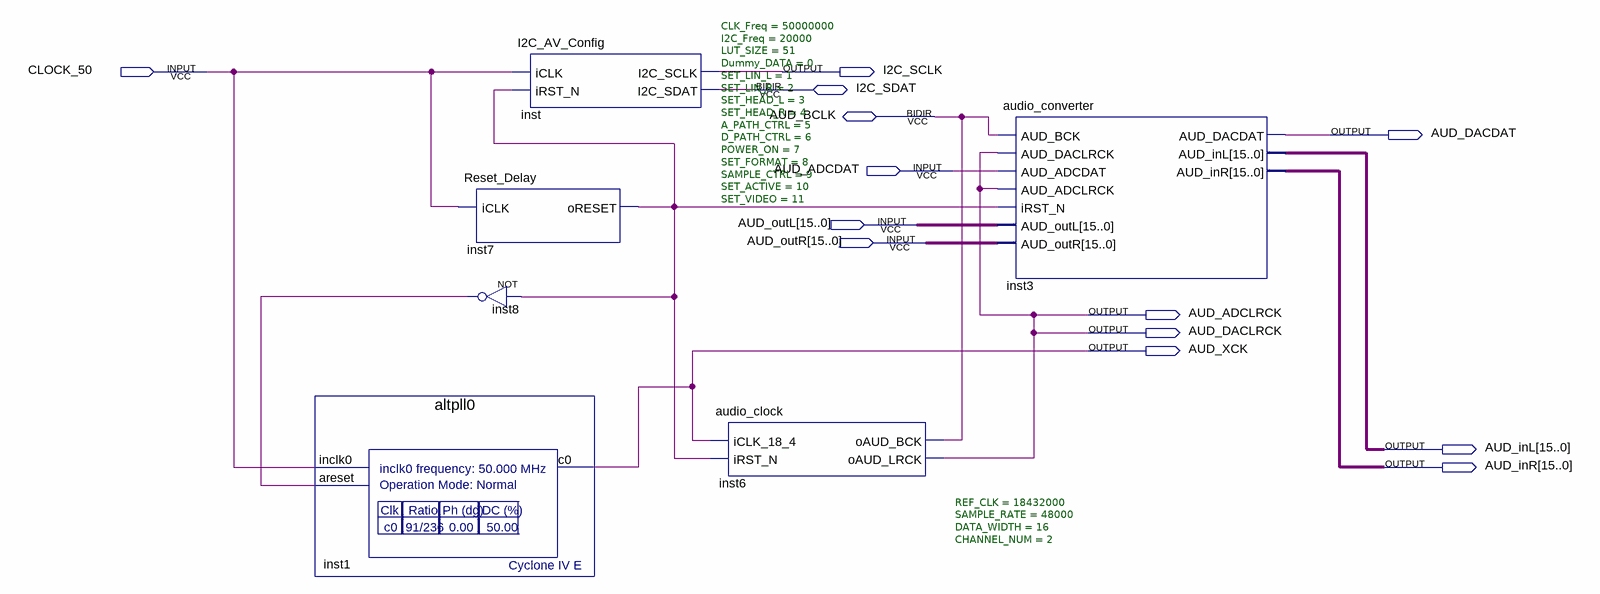
[diagram p0: schematic sheet]
// Quartus schematic DE2_i2sound.bdf as structural Verilog: 6 symbols, 13 pins
module DE2_i2sound (
  input  CLOCK_50,
  input  AUD_ADCDAT,
  input  [15:0] AUD_outL,
  input  [15:0] AUD_outR,
  inout  I2C_SDAT,
  inout  AUD_BCLK,
  output I2C_SCLK,
  output AUD_DACDAT,
  output AUD_ADCLRCK,
  output AUD_DACLRCK,
  output AUD_XCK,
  output [15:0] AUD_inL,
  output [15:0] AUD_inR
);

  wire inst7_oreset, inst8_out;

  altpll0 inst1 (.inclk0(CLOCK_50), .areset(inst8_out), .c0(AUD_XCK));
  Reset_Delay inst7 (.iCLK(CLOCK_50), .oRESET(inst7_oreset));
  not inst8 (inst8_out, inst7_oreset);
  I2C_AV_Config #(.CLK_Freq(50000000), .I2C_Freq(20000), .LUT_SIZE(51), .Dummy_DATA(0), .SET_LIN_L(1), .SET_LIN_R(2), .SET_HEAD_L(3), .SET_HEAD_R(4), .A_PATH_CTRL(5), .D_PATH_CTRL(6), .POWER_ON(7), .SET_FORMAT(8), .SAMPLE_CTRL(9), .SET_ACTIVE(10), .SET_VIDEO(11)) inst (
    .iCLK(CLOCK_50), .iRST_N(inst7_oreset), .I2C_SCLK(I2C_SCLK), .I2C_SDAT(I2C_SDAT));
  audio_clock #(.REF_CLK(18432000), .SAMPLE_RATE(48000), .DATA_WIDTH(16), .CHANNEL_NUM(2)) inst6 (
    .iCLK_18_4(AUD_XCK), .iRST_N(inst7_oreset), .oAUD_BCK(AUD_BCLK), .oAUD_LRCK(AUD_ADCLRCK));
  audio_converter inst3 (
    .AUD_BCK(AUD_BCLK), .AUD_DACLRCK(AUD_ADCLRCK), .AUD_ADCDAT(AUD_ADCDAT), .AUD_ADCLRCK(AUD_ADCLRCK),
    .iRST_N(inst7_oreset), .AUD_outL(AUD_outL), .AUD_outR(AUD_outR), .AUD_DACDAT(AUD_DACDAT),
    .AUD_inL(AUD_inL), .AUD_inR(AUD_inR));

  assign AUD_DACLRCK = AUD_ADCLRCK;
endmodule
